# Altium schematic sheet front_end.SchDoc
size A4
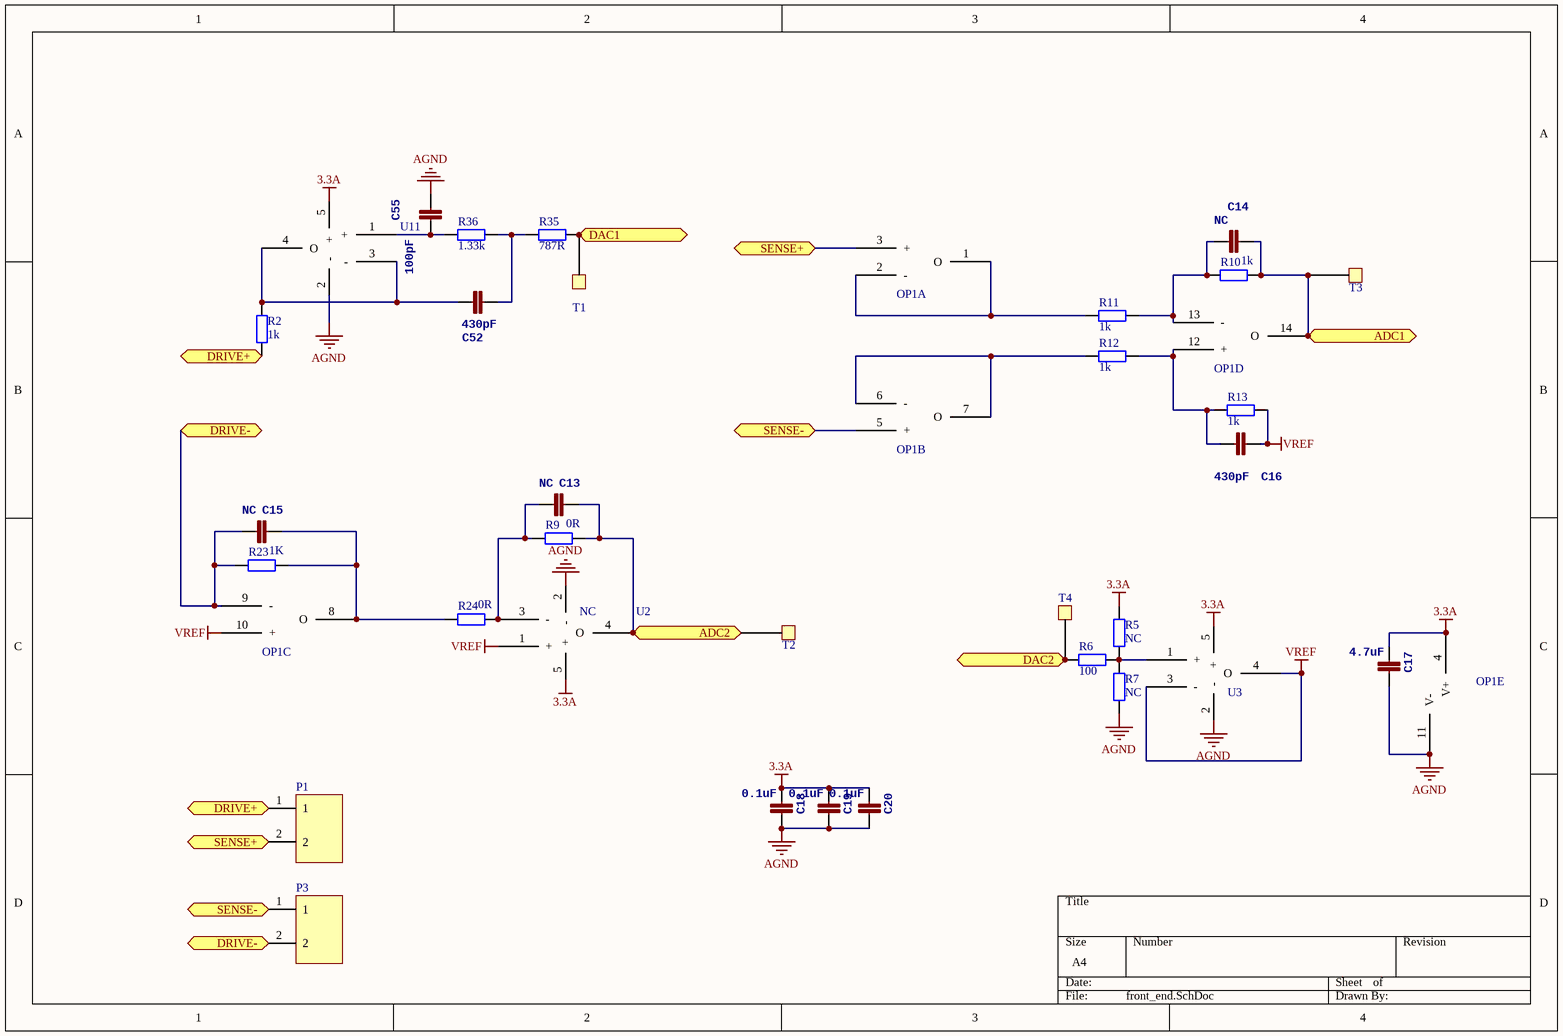
[diagram p0: front_end.SchDoc]

## Parts
C13  NC  [0402]
C14  NC  [0402]
C15  NC  [0402]
C16  430pF  [0402]
C17  4.7uF  [0603]
C18  0.1uF  [0402]
C19  0.1uF  [0402]
C20  0.1uF  [0402]
C52  430pF  [0402]
C55  100pF  [0402]
OP1  MCP6024  [TSSOP14_44MM_065P]  (value not drawn)  (parts A,B,C,D,E of 5)
P1  (no value)  [5.08-2P]
P3  (no value)  [5.08-2P]
R2  1k  [0603]
R5  NC  [0402]
R6  100  [0402]
R7  NC  [0402]
R9  0R  [0402]
R10  1k  [0402]
R11  1k  [0402]
R12  1k  [0402]
R13  1k  [0402]
R23  1K  [0603]
R24  0R  [0402]
R35  787R  [0402]
R36  1.33k  [0402]
T1  (no value)  [TestPad]
T2  (no value)  [TestPad]
T3  (no value)  [TestPad]
T4  (no value)  [TestPad]
U2  NC  [SOT23-5]
U3  OP-SOT23  [SOT23-5]  (value not drawn)
U11  OP-SOT23  [SOT23-5]  (value not drawn)

## Ports
ADC1, ADC2, DAC1, DAC2, DRIVE+, DRIVE-, SENSE+, SENSE-

## Nets
3.3A: C17.2 C18.2 C19.2 C20.2 OP1.4(V+) R5.2 U2.5(+) U3.5(+) U11.5(+)
AGND: C17.1 C18.1 C19.1 C20.1 C55.1 OP1.11(V-) R7.2 U2.2(-) U3.2(-) U11.2(-)
VREF: C16.1 OP1.10(+) R13.1 U2.1(+) U3.3(-) U3.4(O)
ADC1: C14.1 OP1.14(O) R10.1 T3.1 ; port ADC1
ADC2: C13.1 R9.1 T2.1 U2.4(O) ; port ADC2
DAC1: R35.2 T1.1 ; port DAC1
DAC2: R6.2 T4.1 ; port DAC2
DRIVE+: P1.1 R2.2 ; port DRIVE+
DRIVE-: C15.2 OP1.9(-) P3.2 R23.2 ; port DRIVE-
SENSE+: OP1.3(+) P1.2 ; port SENSE+
SENSE-: OP1.5(+) P3.1 ; port SENSE-
NetC13_2: C13.2 R9.2 R24.1 U2.3(-)
NetC14_2: C14.2 OP1.13(-) R10.2 R11.1
NetC15_1: C15.1 OP1.8(O) R23.1 R24.2
NetC16_2: C16.2 OP1.12(+) R12.1 R13.2
NetC52_1: C52.1 R2.1 U11.3(-) U11.4(O)
NetC52_2: C52.2 R35.1 R36.2
NetC55_2: C55.2 R36.1 U11.1(+)
NetOP1_1: OP1.1(O) OP1.2(-) R11.2
NetOP1_6: OP1.6(-) OP1.7(O) R12.2
NetR5_1: R5.1 R6.1 R7.1 U3.1(+)

## Library data of the parts
C13-C20 C52 C55 = CAP0402-CAP: <b>Capacitor</b> / Standard 0603 ceramic capacitor, and 0.1" leaded capacitor.; PARTNO: CC0402ZRY5V7BB104
OP1 = OP-SOP14
P1 P3 = 2P
R2 R5-R7 R9-R13 R23 R24 = Res2: Resistor; Value: 0Ohm; Published: 8-Jun-2000; LatestRevisionDate: 17-Jul-2002; LatestRevisionNote: Re-released for DXP Platform.; PackageReference: AXIAL-0.4; Publisher: Altium Limited; PackageDescription: Axial Device, Thru-Hole; 2 Leads; 0.4 in Pin Spacing
R35 R36 = Res2: Resistor; Published: 8-Jun-2000; LatestRevisionDate: 17-Jul-2002; LatestRevisionNote: Re-released for DXP Platform.; PackageReference: AXIAL-0.4; Publisher: Altium Limited; PackageDescription: Axial Device, Thru-Hole; 2 Leads; 0.4 in Pin Spacing
T1-T4 = TestPad
U2 = OP-SOT23